# Altium schematic sheet CODEC.SchDoc
size A4; SheetNumber: 6; SheetTotal: 9
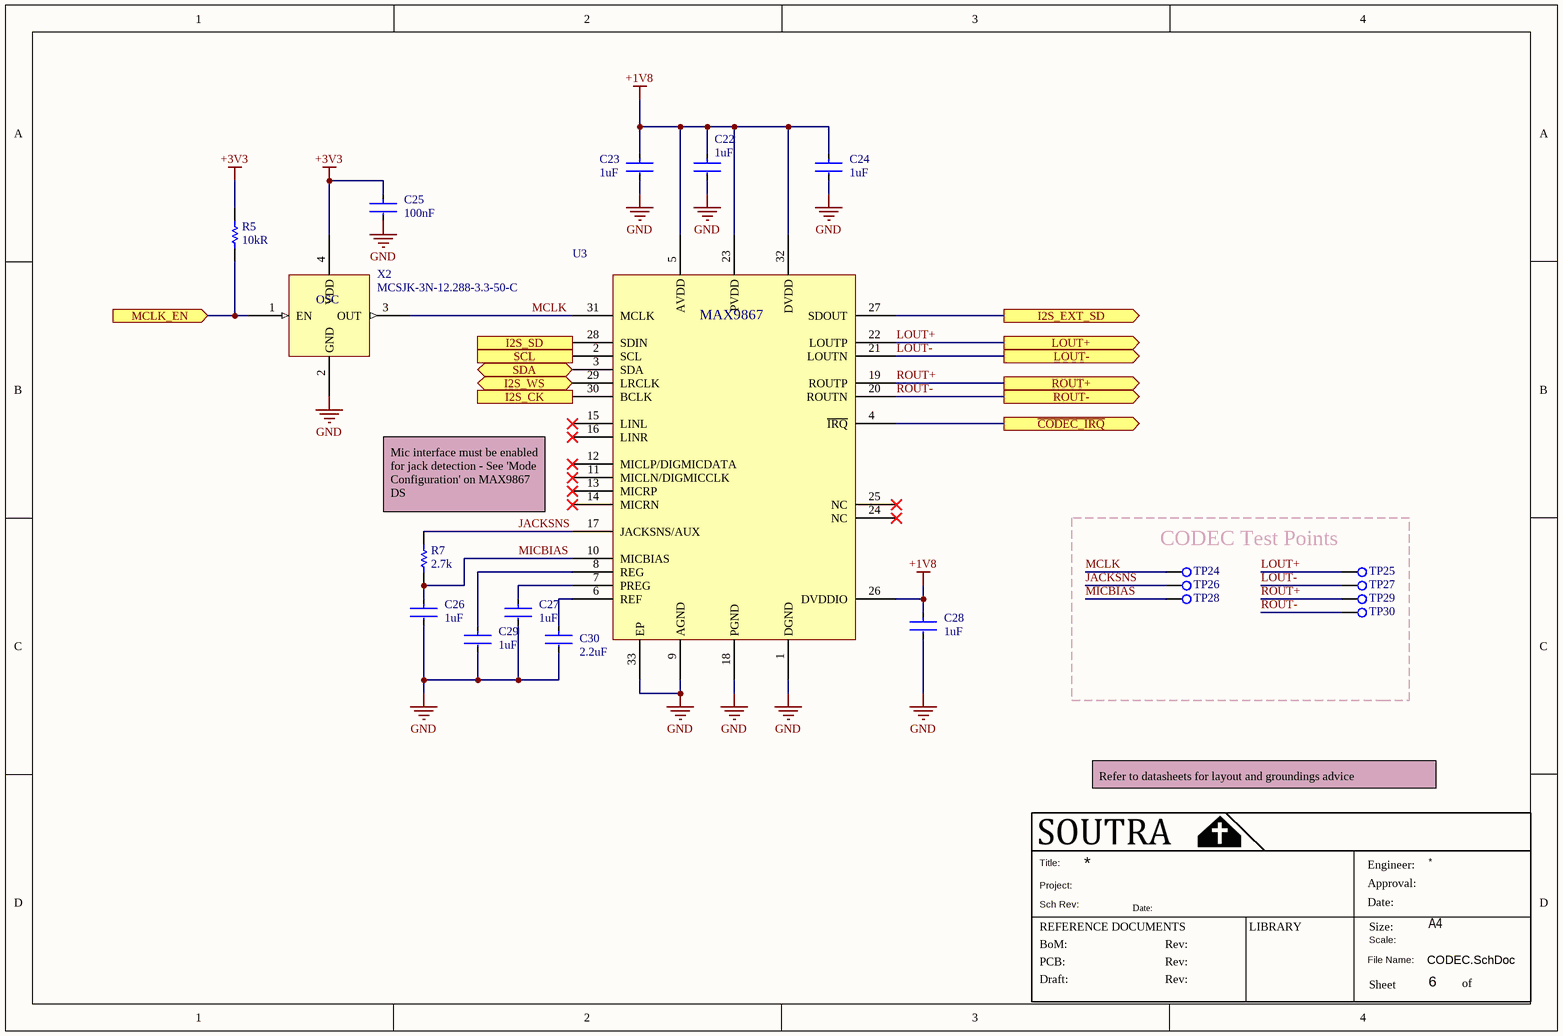
[diagram p0: CODEC.SchDoc]

## Parts
C22  value 1uF  [CAPC1005X06L]  (hidden comment: CC0402KRX5R6BB105)
C23  value 1uF  [CAPC1005X06L]  (hidden comment: CC0402KRX5R6BB105)
C24  value 1uF  [CAPC1005X06L]  (hidden comment: CC0402KRX5R6BB105)
C25  value 100nF  [CAPC1005X06L]  (hidden comment: 0402X104M160CT)
C26  value 1uF  [CAPC1005X06L]  (hidden comment: CC0402KRX5R6BB105)
C27  value 1uF  [CAPC1005X06L]  (hidden comment: CC0402KRX5R6BB105)
C28  value 1uF  [CAPC1005X06L]  (hidden comment: CC0402KRX5R6BB105)
C29  value 1uF  [CAPC1005X06L]  (hidden comment: CC0402KRX5R6BB105)
C30  value 2.2uF  [CAPC1005X06L]  (hidden comment: CC0402MRX5R5BB225)
R5  value 10kR  [RESC_0805_2013X50X30LL20T20]  (hidden comment: RC0805JR-0710KL)
R7  value 2.7k  [RESC_0805_2013X50X30LL20T20]  (hidden comment: CRGH0805F2K7)
TP24  TP_CIRCLE_R1  [TP_CIRCLE_R1]  (value not drawn)
TP25  TP_CIRCLE_R1  [TP_CIRCLE_R1]  (value not drawn)
TP26  TP_CIRCLE_R1  [TP_CIRCLE_R1]  (value not drawn)
TP27  TP_CIRCLE_R1  [TP_CIRCLE_R1]  (value not drawn)
TP28  TP_CIRCLE_R1  [TP_CIRCLE_R1]  (value not drawn)
TP29  TP_CIRCLE_R1  [TP_CIRCLE_R1]  (value not drawn)
TP30  TP_CIRCLE_R1  [TP_CIRCLE_R1]  (value not drawn)
U3  (no value)  [TQFN50P500X500X80_HS-33L]
X2  MCSJK-3N-12.288-3.3-50-C  [X_MULTICOMP_MCSJK-3N-12.288-3.3-50-C]

## Blocks framed on the sheet
CODEC Test Points: TP24-TP30

## Ports
I2S_CK (in, see Block Diagram[3A], MCU[3B]), I2S_EXT_SD (out, see Block Diagram[3A], MCU[3B]), I2S_SD (in, see Block Diagram[3B], MCU[3B]), I2S_WS (bidir, see Block Diagram[3A], MCU[3B]), LOUT+ (out, see Block Diagram[4A], Amplifiers[1B], IOa[3A]), LOUT- (out, see Block Diagram[4A], Amplifiers[1B]), MCLK_EN (in, see Block Diagram[3B], MCU[2B]), ROUT+ (out, see Block Diagram[4A], Amplifiers[3B], IOa[3A]), ROUT- (out, see Block Diagram[4B], Amplifiers[3B]), SCL (in, see Block Diagram[3B], IOa[1C], MCU[4B]), SDA (bidir, see Block Diagram[3B], IOa[1C], MCU[4B]), ~{CODEC_IRQ} (out, see Block Diagram[3B], MCU[3B])

## Nets
+1V8: C22.1 C23.1 C24.1 C28.1 U3.5(AVDD) U3.23(PVDD) U3.26(DVDDIO) U3.32(DVDD)
+3V3: C25.1 R5.2 X2.4(VDD)
GND: C22.2 C23.2 C24.2 C25.2 C26.2 C27.2 C28.2 C29.2 C30.2 U3.1(DGND) U3.9(AGND) U3.18(PGND) U3.33(EP) X2.2(GND)
~{CODEC_IRQ}: U3.4(~{IRQ}) ; port ~{CODEC_IRQ}
I2S_CK: U3.30(BCLK) ; port I2S_CK
I2S_EXT_SD: U3.27(SDOUT) ; port I2S_EXT_SD
I2S_SD: U3.28(SDIN) ; port I2S_SD
I2S_WS: U3.29(LRCLK) ; port I2S_WS
JACKSNS: R7.1 TP26.1 U3.17(JACKSNS/AUX)
LOUT+: TP25.1 U3.22(LOUTP) ; port LOUT+
LOUT-: TP27.1 U3.21(LOUTN) ; port LOUT-
MCLK: TP24.1 U3.31(MCLK) X2.3(OUT)
MCLK_EN: R5.1 X2.1(EN) ; port MCLK_EN
MICBIAS: C26.1 R7.2 TP28.1 U3.10(MICBIAS)
ROUT+: TP29.1 U3.19(ROUTP) ; port ROUT+
ROUT-: TP30.1 U3.20(ROUTN) ; port ROUT-
SCL: U3.2(SCL) ; port SCL
SDA: U3.3(SDA) ; port SDA
NetC27_1: C27.1 U3.7(PREG)
NetC29_1: C29.1 U3.8(REG)
NetC30_1: C30.1 U3.6(REF)

Not connected (* = marked no-connect by the designer): U3 11(MICLN/DIGMICCLK)* 12(MICLP/DIGMICDATA)* 13(MICRP)* 14(MICRN)* 15(LINL)* 16(LINR)* 24(NC)* 25(NC)*

## Notes on the sheet
- (near R7) Mic interface must be enabled for jack detection - See 'Mode Configuration' on MAX9867 DS
- Refer to datasheets for layout and groundings advice
- Title:
- Project:
- Sch Rev:
- Date:
- Engineer:
- Approval:
- REFERENCE DOCUMENTS
- BoM:
- PCB:
- Draft:
- Rev:
- LIBRARY
- File Name:
- Scale:
- Size:
- Sheet
- A4
- of
- (in symbol MAX9867ETJ+T) MAX9867
- (in symbol MCSJK-3N-12.288-3.3-50-C) OSC

## Library data of the parts
C22-C24 C26-C29 = CC0402KRX5R6BB105: Ceramic Capacitor, Multilayer, Ceramic, 10V, 10% +Tol, 10% -Tol, X5R, 15% TC, 1uF, Surface Mount, 0402; Manufacturer: Yageo; Alternative Part: 0402ZD105KAT2A; Alternative Part Manufacturer: KYOCERA AVX; Multilayer: Yes; Supplier: Farnell; Supplier Part Number: 1458896; Manufacturer Part Number: CC0402KRX5R6BB105; RoHS: Yes; Category: Ceramic Capacitors; Stock: 12220000; Pricing: 10=0.039, 100=0.023; Mounting Technology: Surface Mount; Pins: 2; Dielectric Material: Ceramic; Package Shape: Rectangular; Case/Package: 0402; Terminal Finish: Nickel; Min Operating Temperature: -55°C; Max Operating Temperature: 85°C; JESD-609 Code: e3; Capacitor Type: Ceramic; Tolerance  (fill in as +-): 10%; Package Style: SMTMeter; Packaging: Tape and Reel; Tolerance (fill in as +-): 10%; Rated DC Voltage (URdc): 10V; Temperature Characteristics Code: X5R; Termination: Wraparound; Length: 1mm; Width: 0.5mm; Height: 0.5mm; Reach SVHC Compliant: Yes; RoHS Compliant: Yes; ComponentLink1URL: https://datasheet.ciiva.com:443/pdfs/VipMasterIC/IC/YAGO/YAGO-S-A0006851646/YAGO-S-A0006851646-1.pdf?src-supplier=IHS+Markit; ComponentLink1Description: https://datasheet.ciiva.com:443/pdfs/VipMasterIC/IC/YAGO/YAGO-S-A0006851646/YAGO-S-A0006851646-1.pdf?src-supplier=IHS+Markit; ComponentLink2URL: https://datasheet.ciiva.com/176/upy-gphc-x5r-4v-to-50v-12-176704.pdf?src-supplier=Digi-Key; ComponentLink2Description: https://datasheet.ciiva.com/176/upy-gphc-x5r-4v-to-50v-12-176704.pdf?src-supplier=Digi-Key; ComponentLink3URL: https://datasheet.ciiva.com/176/mlccorderingcode-176705.pdf?src-supplier=Digi-Key; ComponentLink3Description: https://datasheet.ciiva.com/176/mlccorderingcode-176705.pdf?src-supplier=Digi-Key; ComponentLink4URL: https://datasheet.ciiva.com/176/mlccorderingcode-176706.pdf?src-supplier=Digi-Key; ComponentLink4Description: https://datasheet.ciiva.com/176/mlccorderingcode-176706.pdf?src-supplier=Digi-Key; Supplier 1: Digikey; Supplier Part Number 1: 311-1439-1-ND; Pricing 1: 1=0.08, 10=0.058, 50=0.034, 100=0.027; Alternative Part Supplier: Farnell; Alternative Part Supplier Part Number: 1740588
C25 = 0402X104M160CT: Ceramic Capacitor, Multilayer, Ceramic, 16V, 20% +Tol, 20% -Tol, X5R, 15% TC, 0.1uF, Surface Mount, 0402; Manufacturer: Walsin Technologies; Alternative Part: 885012105016; Alternative Part Manufacturer: WURTH; Multilayer: Yes; Supplier: Farnell; Supplier Part Number: 2524808; Manufacturer Part Number: 0402X104M160CT; RoHS: Yes; Category: Ceramic Capacitors; Stock: 1101; Pricing: 10=0.0047, 100=0.0043; Mounting Technology: Surface Mount; Pins: 2; Dielectric Material: Ceramic; Package Shape: Rectangular; Case/Package: 0402; Terminal Finish: Nickel; Min Operating Temperature: -55°C; Max Operating Temperature: 85°C; JESD-609 Code: e3; Capacitor Type: Ceramic; Tolerance  (fill in as +-): 20%; Package Style: SMTMeter; Packaging: Tape and Reel; Tolerance (fill in as +-): 20%; Rated DC Voltage (URdc): 16V; Temperature Characteristics Code: X5R; Termination: Wraparound; Length: 1mm; Width: 0.5mm; Height: 0.5mm; Reach SVHC Compliant: Yes; RoHS Compliant: Yes; ComponentLink1URL: https://datasheet.ciiva.com:443/pdfs/VipMasterIC/IC/WATC/WATC-S-A0009550342/WATC-S-A0009550342-1.pdf?src-supplier=IHS+Markit; ComponentLink1Description: https://datasheet.ciiva.com:443/pdfs/VipMasterIC/IC/WATC/WATC-S-A0009550342/WATC-S-A0009550342-1.pdf?src-supplier=IHS+Markit; ComponentLink2URL: http://www.farnell.com/datasheets/2009679.pdf?src-supplier=Farnell; ComponentLink2Description: http://www.farnell.com/datasheets/2009679.pdf?src-supplier=Farnell; ComponentLink3URL: http://www.farnell.com/datasheets/2340522.pdf?src-supplier=Farnell; ComponentLink3Description: http://www.farnell.com/datasheets/2340522.pdf?src-supplier=Farnell; ComponentLink4URL: https://datasheet.octopart.com/0402X104M160CT-Walsin-Technologies-datasheet-85392065.pdf?src-supplier=Element14; ComponentLink4Description: https://datasheet.octopart.com/0402X104M160CT-Walsin-Technologies-datasheet-85392065.pdf?src-supplier=Element14; ComponentLink5URL: https://datasheet.octopart.com/0402X104M160CT-Walsin-Technologies-datasheet-136037192.pdf?src-supplier=TECHDesign; ComponentLink5Description: https://datasheet.octopart.com/0402X104M160CT-Walsin-Technologies-datasheet-136037192.pdf?src-supplier=TECHDesign; Supplier Part Number 1: 1292-0402X104M160CT-ND; Supplier 1: Digikey; Pricing 1: 1=0.08, 10=0.023, 50=0.013, 100=0.01; Alternative Part Supplier: Farnell; Alternative Part Supplier Part Number: 2533933
C30 = CC0402MRX5R5BB225: Ceramic Capacitor, Multilayer, Ceramic, 6.3V, 20% +Tol, 20% -Tol, X5R, 15% TC, 2.2uF, Surface Mount, 0402; Manufacturer: Yageo; Alternative Part: MC0402X225M6R3CT; Multilayer: Yes; Suppler 2: Digikey; Supplier 1: Farnell; Supplier Part Number 1: 3369189; Manufacturer Part Number: CC0402MRX5R5BB225; RoHS: Yes; Category: Ceramic Capacitors; Stock 1: 22402; Pricing 1: 10=0.0794, 100=0.0451; Mounting Technology: Surface Mount; Pins: 2; Dielectric Material: Ceramic; Package Shape: Rectangular; Case/Package: 0402; Terminal Finish: Nickel; Min Operating Temperature: -55°C; Max Operating Temperature: 85°C; JESD-609 Code: e3; Capacitor Type: Ceramic; Tolerance  (fill in as +-): 20%; Package Style: SMTMeter; Packaging: Tape and Reel; Tolerance (fill in as +-): 20%; Rated DC Voltage (URdc): 6.3V; Temperature Characteristics Code: X5R; Termination: Wraparound; Length: 1mm; Width: 0.5mm; Height: 0.5mm; Reach SVHC Compliant: Yes; RoHS Compliant: Yes; ComponentLink1URL: https://datasheet.ciiva.com:443/pdfs/VipMasterIC/IC/YAGO/YAGO-S-A0006851646/YAGO-S-A0006851646-1.pdf?src-supplier=IHS+Markit; ComponentLink1Description: https://datasheet.ciiva.com:443/pdfs/VipMasterIC/IC/YAGO/YAGO-S-A0006851646/YAGO-S-A0006851646-1.pdf?src-supplier=IHS+Markit; ComponentLink2URL: https://datasheet.ciiva.com/180/mlccorderingcode-180426.pdf?src-supplier=Digikey; ComponentLink2Description: https://datasheet.ciiva.com/180/mlccorderingcode-180426.pdf?src-supplier=Digikey; ComponentLink3URL: https://datasheet.ciiva.com/180/mlccorderingcode-180428.pdf?src-supplier=Digikey; ComponentLink3Description: https://datasheet.ciiva.com/180/mlccorderingcode-180428.pdf?src-supplier=Digikey; ComponentLink4URL: https://datasheet.ciiva.com/180/mlccorderingcode-180427.pdf?src-supplier=Digikey; ComponentLink4Description: https://datasheet.ciiva.com/180/mlccorderingcode-180427.pdf?src-supplier=Digikey; Supplier Part Number 2: 311-1442-1-ND; Stock 2: 156931; Pricing 2: 1=0.09, 10=0.06, 50=0.038, 100=0.030; Alternative Part Supplier: Farnell; Alternative Part Supplier Part Number: 1759376
R5 = RC0805JR-0710KL: Fixed Resistor, Metal Glaze/thick Film, 0.125W, 10000ohm, 150V, 5% +/-Tol, 100ppm/Cel, Surface Mount, 0805; Manufacturer: Yageo; Alternative Part: MCMR08X103 JTL; Additional Feature: LASER TRIMMABLE; Power: 125mW; Rated Temperature: 70°C; Temperature Coefficient: 100ppm/°C; Package Height: 0.5mm; Package Length: 2mm; Package Width: 1.25mm; Supplier: Farnell; Supplier Part Number: 9234136; Manufacturer Part Number: RC0805JR-0710KL; RoHS: Yes; Category: Chip SMD Resistors; Stock: 893694; Pricing: 10=0.013, 100=0.007, 500=0.006; Mounting Technology: Surface Mount; Pins: 2; Package Shape: Rectangular; Case/Package: 0805; Terminal Finish: Nickel; Min Operating Temperature: -55°C; Max Operating Temperature: 155°C; Tolerance: 5%; JESD-609 Code: e3; Resistor Type: FIXED RESISTOR; Construction: Chip; Package Style: SMTMeter; Packaging: Tape and Reel; Technology: METAL GLAZE/THICK FILM; Termination: Wraparound; Working Voltage: 150V; Reach SVHC Compliant: Yes; RoHS Compliant: Yes; ComponentLink1URL: https://datasheet.ciiva.com:443/pdfs/VipMasterIC/IC/YAGO/YAGO-S-A0008145938/YAGO-S-A0008145938-1.pdf?src-supplier=IHS+Markit; ComponentLink1Description: https://datasheet.ciiva.com:443/pdfs/VipMasterIC/IC/YAGO/YAGO-S-A0008145938/YAGO-S-A0008145938-1.pdf?src-supplier=IHS+Markit; ComponentLink2URL: https://datasheet.ciiva.com/7983/444164-7983765.pdf?src-supplier=Element14; ComponentLink2Description: https://datasheet.ciiva.com/7983/444164-7983765.pdf?src-supplier=Element14; ComponentLink3URL: https://datasheet.ciiva.com/7941/444164-7941870.pdf?src-supplier=Element14; ComponentLink3Description: https://datasheet.ciiva.com/7941/444164-7941870.pdf?src-supplier=Element14; ComponentLink4URL: https://datasheet.ciiva.com/7941/444164-7941871.pdf?src-supplier=Element14; ComponentLink4Description: https://datasheet.ciiva.com/7941/444164-7941871.pdf?src-supplier=Element14; Supplier 1: Digikey; Supplier Part Number 1: 311-10KARCT-ND; Pricing 1: 1=0.08, 10=0.018, 50=0.011, 100=0.009; Alternative Part Supplier: Farnell; Alternative Part Supplier Part Number: 2073612
R7 = CRGH0805F2K7: Fixed Resistor, Metal Glaze/thick Film, 0.33W, 2700ohm, 150V, 1% +/-Tol, 100ppm/Cel, Surface Mount, 0805; Manufacturer: TE Connectivity; Alternative Part: MC01W08051100R; Alternative Part Manufacturer: Multicomp Pro; Supplier: Farnell; Supplier Part Number: 2332077; Manufacturer Part Number: CRGH0805F2K7; RoHS: Yes; Category: Chip SMD Resistors; Stock: 2438; Pricing: 10=0.0381; Pins: 2; Resistor Type: FIXED RESISTOR; Reach SVHC Compliant: Yes; RoHS Compliant: Yes; ComponentLink1URL: https://www.te.com:443/usa-en/product-1-2176185-0.datasheet.pdf?src-supplier=IHS+Markit; ComponentLink1Description: https://www.te.com:443/usa-en/product-1-2176185-0.datasheet.pdf?src-supplier=IHS+Markit; ComponentLink2URL: https://datasheet.ciiva.com/22670/1755795-22670377.pdf?src-supplier=Element14; ComponentLink2Description: https://datasheet.ciiva.com/22670/1755795-22670377.pdf?src-supplier=Element14; ComponentLink3URL: https://datasheet.ciiva.com/28583/1755795-28583016.pdf?src-supplier=Element14; ComponentLink3Description: https://datasheet.ciiva.com/28583/1755795-28583016.pdf?src-supplier=Element14; Supplier 1: Mouser; Supplier Part Number 1: 279-CRGH0805F2K7; Pricing 1: 1=0.096, 10=0.065, 100=0.033; Alternative Part Supplier: Farnell; Alternative Part Supplier Part Number: 9332375
TP24-TP30 = TP_CIRCLE_R1: Test Point, SMD, Circular, Radius = 1mm
U3 = MAX9867ETJ+T: PCM Codec; Manufacturer: Maxim; Supplier: Farnell; Supplier Part Number: 2517273; Manufacturer Part Number: MAX9867ETJ+T; RoHS: Yes; Category: CODECs; Stock: 1095; Pricing: 1=2.92, 10=2.45, 25=2.3, 100=2.15; Telecom IC Type: PCM CODEC; Moisture Sensitivity Level: 1; Reach SVHC Compliant: Yes; RoHS Compliant: Yes; ComponentLink1URL: https://datasheet.ciiva.com:443/pdfs/VipMasterIC/IC/MAXM/MAXMS11328/MAXMS11328-1.pdf?src-supplier=IHS+Markit; ComponentLink1Description: https://datasheet.ciiva.com:443/pdfs/VipMasterIC/IC/MAXM/MAXMS11328/MAXMS11328-1.pdf?src-supplier=IHS+Markit; ComponentLink2URL: https://datasheet.ciiva.com/1694/max9867-1694642.pdf?src-supplier=Digikey; ComponentLink2Description: https://datasheet.ciiva.com/1694/max9867-1694642.pdf?src-supplier=Digikey; Supplier 1: Digikey; Supplier Part Number 1: MAX9867ETJ+TCT-ND; Pricing 1: 1=2.95, 10=2.65, 25=2.5, 100=2.17
X2 = MCSJK-3N-12.288-3.3-50-C: CMOS Output Clock Oscillator; Manufacturer: Multicomp; Supplier 1: Farnell; Supplier Part Number 1: 2854277; Manufacturer Part Number: MCSJK-3N-12.288-3.3-50-C; RoHS: No; Stock 1: 2585; Pricing 1: 5=0.644, 50=0.522, 250=0.455, 500=0.442, 1500=0.436, 3000=0.43, 15000=0.421, 30000=0.413 (GBP)